# EasyEDA schematic radio-KATTINY85.json
TITLE: KSR-ATT85; REV: 1.0; Date: 2024-06-19; Sheet: 1/1; Company: KS Inc.
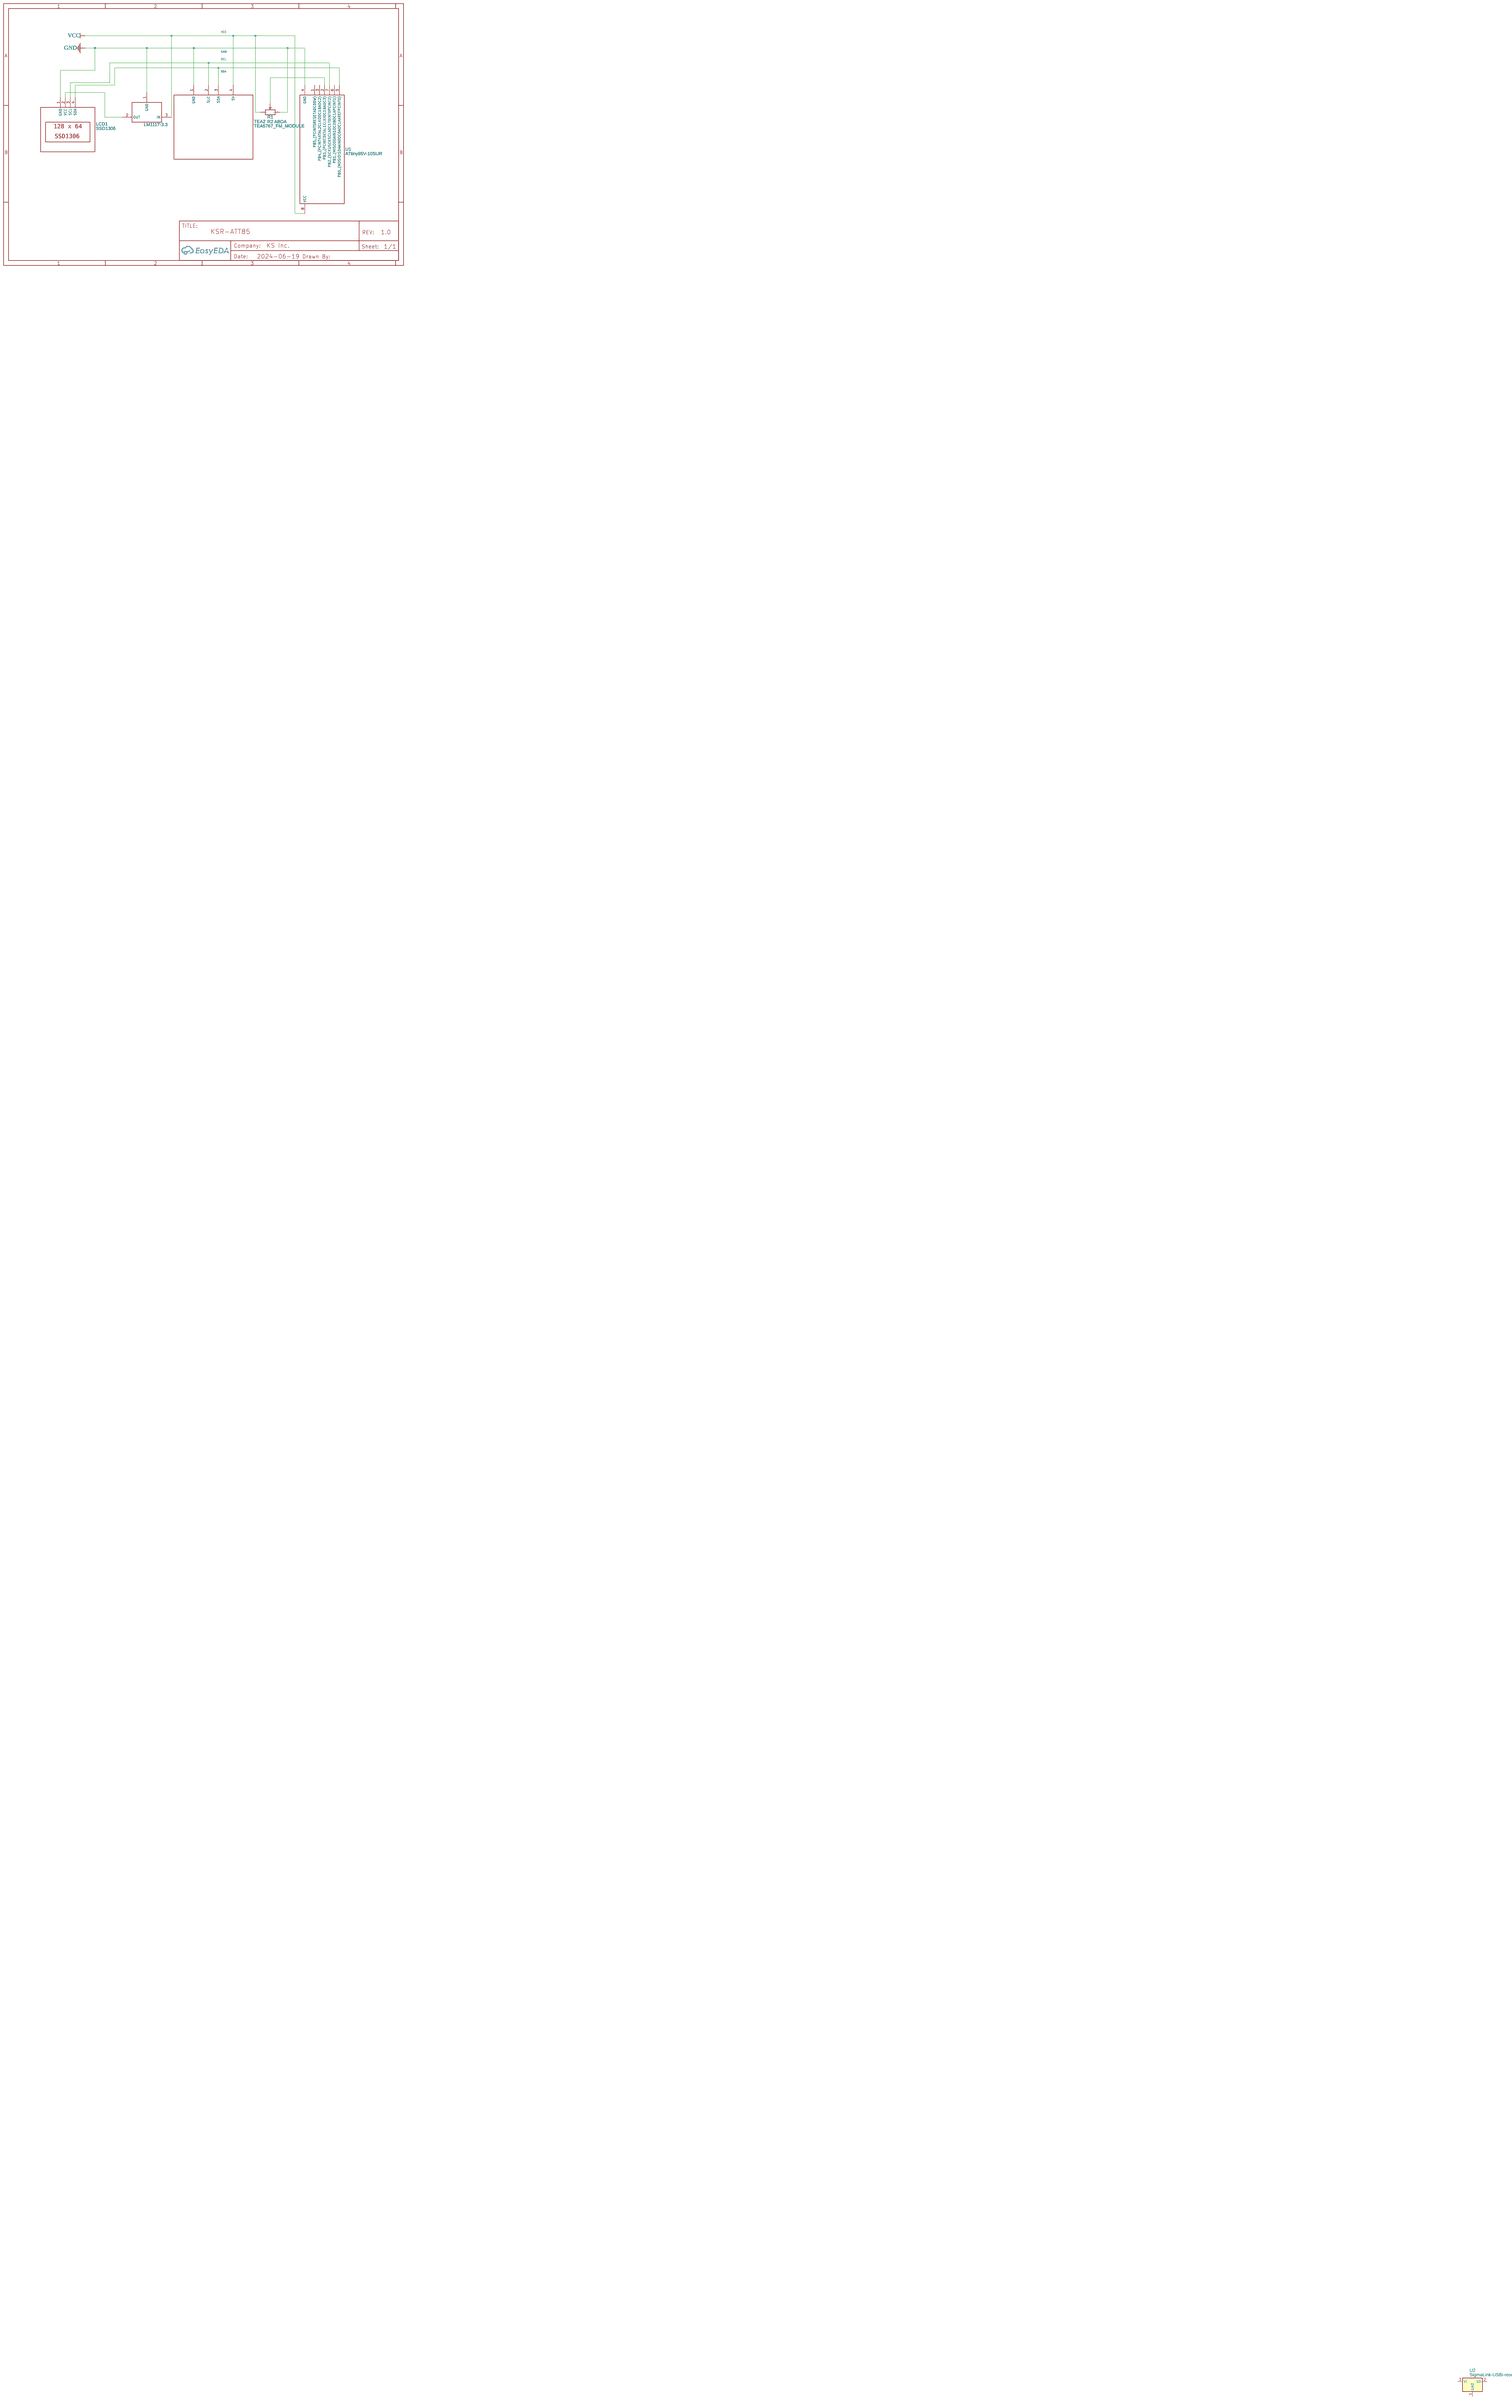
[diagram p0: schematic sheet]

## Parts
LCD1  SSD1306  [SSD1306-OLED-128X64-I2C]
LM1117-3  LM1117-3.3V TO-220  [LM1117-3.3 UP]  (section 3)
R1  R2 ABDA  [POTENTIOMÈTRE PCB]
TEA2  TEA5767_FM_MODULE  [TEA5767_FM_MODULE]
U1  ATtiny85V-10SUR  [SOP-8]
U2  SigmaLink-USBi-rescue:LM1117-3.3  [LM1117-3.3]

## Library data of the parts
LCD1 = SSD1306-OLED-COMET-DUST-CUSTOM COPY: Contributor: Karas
LM1117-3 = LM1117-3.3V TO-220: Contributor: dimitr_dm
R1 = R2 ABDA: Manufacturer: CTS; Supplier: Tube Town; Supplier Part: pma-100log; link: https://www.tube-town.net/ttstore/potentiometer-for-marshall-jcm800-100-kohm-log.html; Contributor: Djay
TEA2 = TEA5767_FM_MODULE: Contributor: Çağdaş ARDA
U1 = ATtiny85V-10SUR: 8-bit AVR Microcontroller, 10MHz, 1.8-5.5V, 8K Flash, 512 Bytes EEPROM, 512 Bytes SRAM, Industrial Grade (-40u7648 to 85u7648), 8-Lead SOIC, Pb-Free, Reel
U2 = SigmaLink-USBi-rescue:LM1117-3.3: Contributor: valtra103

## Nets
GND: LCD1.1(GND) LM1117-3.1(GND) R1.3 TEA2.1(GND) U1.4(GND)
VCC: LM1117-3.3(IN) R1.1 TEA2.4(5V) U1.8(VCC)
Net-(LCD1-2): LCD1.2(VCC) LM1117-3.2(OUT)
Net-(LCD1-3): LCD1.3(SCL) TEA2.2(SLC) U1.7(PB2 (SCKUSCKSCLADC1T0INT0PCINT2))
Net-(LCD1-4): LCD1.4(SDA) TEA2.3(SDA) U1.5(PB0 (MOSIDISDAAIN0OC0AOC1AAREFPCINT0))
Net-(R1-2): R1.2 U1.2(PB3 (PCINT3XTAL1CLKIOC1BADC3))

Not connected (* = marked no-connect by the designer): U1 1(PB5 (PCINT5RESETADC0DW)) 3(PB4 (PCINT4XTAL2CLKOOC1BADC2)) 6(PB1 (MISODOAIN1OC0BOC1APCINT1)); U2 1(GND) 2(VO) 3(VI)

## Notes on the sheet
- VCC
- GND
- SCL
- SDA
